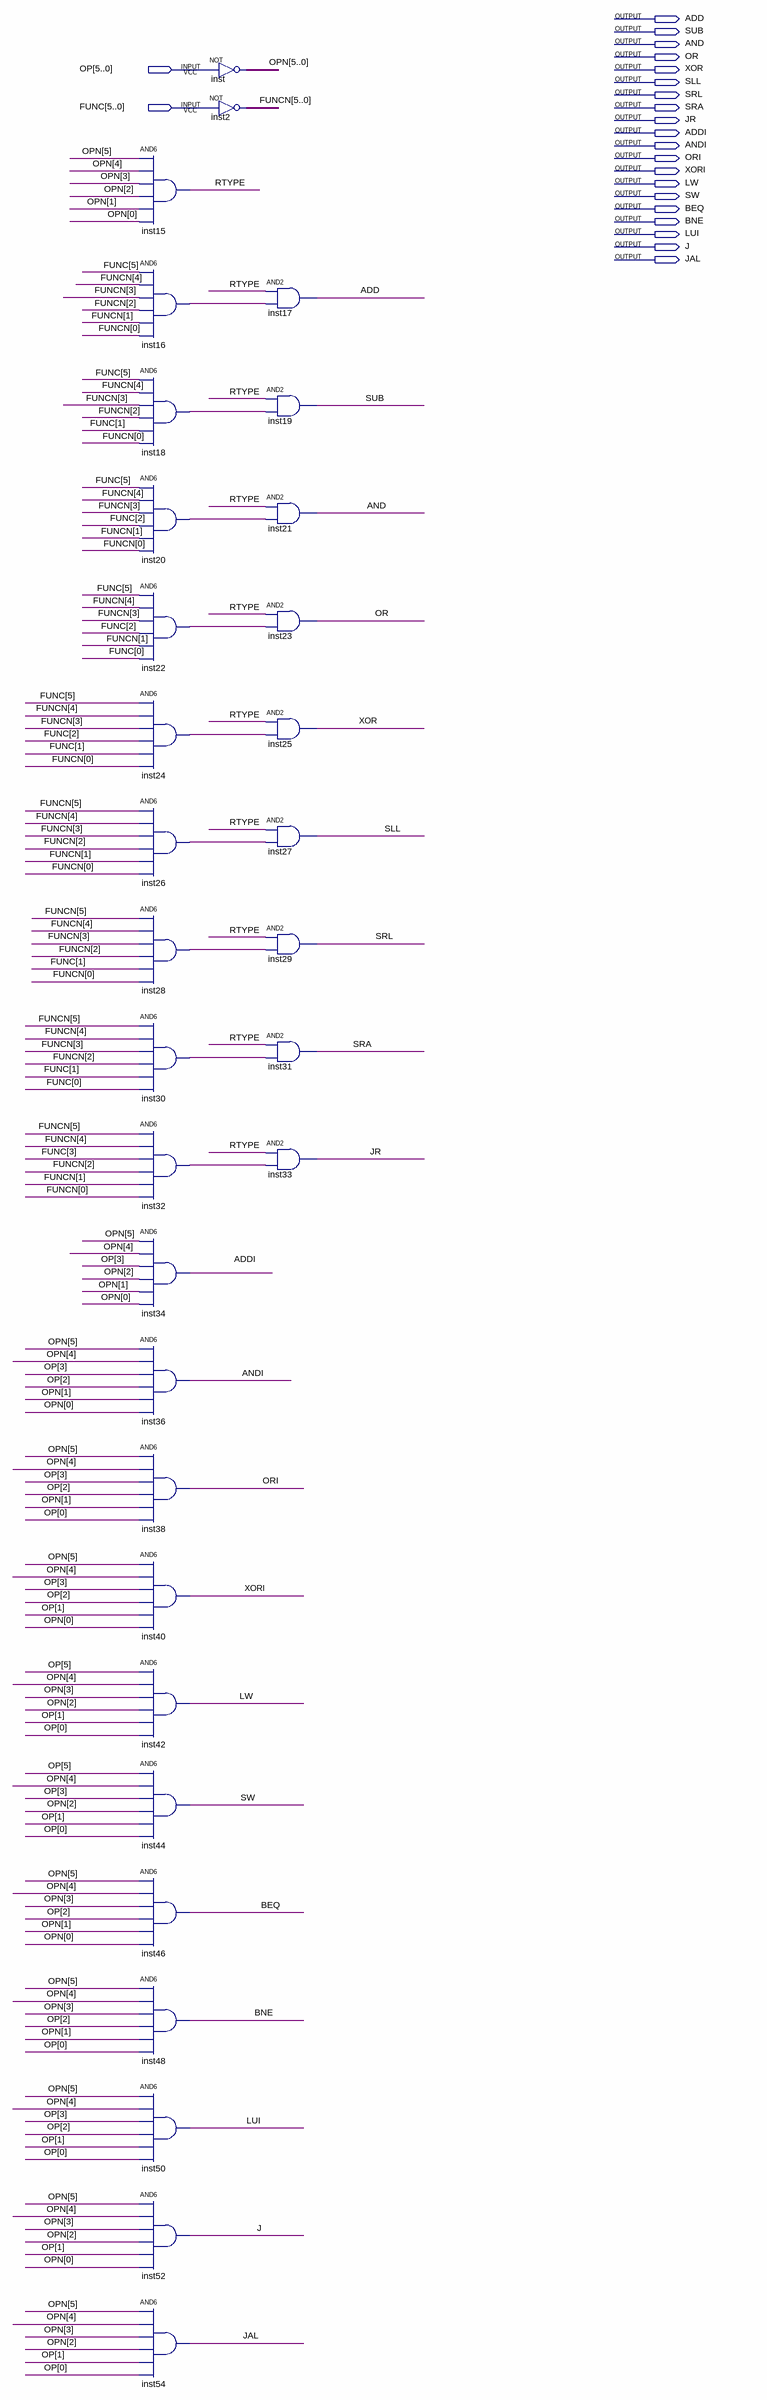
[diagram p0: schematic sheet]
// Quartus schematic instdex.bdf as structural Verilog: 32 symbols, 22 pins
module instdex (
  input  [5:0] OP,
  input  [5:0] FUNC,
  output ADD,
  output SUB,
  output AND,
  output OR,
  output XOR,
  output SLL,
  output SRL,
  output SRA,
  output JR,
  output ADDI,
  output ANDI,
  output ORI,
  output XORI,
  output LW,
  output SW,
  output BEQ,
  output BNE,
  output LUI,
  output J,
  output JAL
);

  wire inst16_out, inst18_out, inst20_out, inst22_out, inst24_out, inst26_out, inst28_out, inst30_out,
       inst32_out, RTYPE;
  wire [5:0] FUNCN, OPN;

  and inst15 (RTYPE, OPN[5], OPN[4], OPN[3], OPN[2], OPN[1], OPN[0]);
  and inst16 (inst16_out, FUNC[5], FUNCN[4], FUNCN[3], FUNCN[2], FUNCN[1], FUNCN[0]);
  and inst18 (inst18_out, FUNC[5], FUNCN[4], FUNCN[3], FUNCN[2], FUNC[1], FUNCN[0]);
  and inst20 (inst20_out, FUNC[5], FUNCN[4], FUNCN[3], FUNC[2], FUNCN[1], FUNCN[0]);
  and inst22 (inst22_out, FUNC[5], FUNCN[4], FUNCN[3], FUNC[2], FUNCN[1], FUNC[0]);
  and inst24 (inst24_out, FUNC[5], FUNCN[4], FUNCN[3], FUNC[2], FUNC[1], FUNCN[0]);
  and inst26 (inst26_out, FUNCN[5], FUNCN[4], FUNCN[3], FUNCN[2], FUNCN[1], FUNCN[0]);
  and inst28 (inst28_out, FUNCN[5], FUNCN[4], FUNCN[3], FUNCN[2], FUNC[1], FUNCN[0]);
  and inst30 (inst30_out, FUNCN[5], FUNCN[4], FUNCN[3], FUNCN[2], FUNC[1], FUNC[0]);
  and inst32 (inst32_out, FUNCN[5], FUNCN[4], FUNC[3], FUNCN[2], FUNCN[1], FUNCN[0]);
  and inst34 (ADDI, OPN[5], OPN[4], OP[3], OPN[2], OPN[1], OPN[0]);
  and inst36 (ANDI, OPN[5], OPN[4], OP[3], OP[2], OPN[1], OPN[0]);
  and inst38 (ORI, OPN[5], OPN[4], OP[3], OP[2], OPN[1], OP[0]);
  and inst40 (XORI, OPN[5], OPN[4], OP[3], OP[2], OP[1], OPN[0]);
  and inst42 (LW, OP[5], OPN[4], OPN[3], OPN[2], OP[1], OP[0]);
  and inst44 (SW, OP[5], OPN[4], OP[3], OPN[2], OP[1], OP[0]);
  and inst46 (BEQ, OPN[5], OPN[4], OPN[3], OP[2], OPN[1], OPN[0]);
  and inst48 (BNE, OPN[5], OPN[4], OPN[3], OP[2], OPN[1], OP[0]);
  and inst50 (LUI, OPN[5], OPN[4], OP[3], OP[2], OP[1], OP[0]);
  and inst52 (J, OPN[5], OPN[4], OPN[3], OPN[2], OP[1], OPN[0]);
  and inst54 (JAL, OPN[5], OPN[4], OPN[3], OPN[2], OP[1], OP[0]);
  assign OPN = ~OP;  // NOT inst, 6 bits wide
  assign FUNCN = ~FUNC;  // NOT inst2, 6 bits wide
  and inst17 (ADD, RTYPE, inst16_out);
  and inst19 (SUB, RTYPE, inst18_out);
  and inst21 (AND, RTYPE, inst20_out);
  and inst23 (OR, RTYPE, inst22_out);
  and inst25 (XOR, RTYPE, inst24_out);
  and inst27 (SLL, RTYPE, inst26_out);
  and inst29 (SRL, RTYPE, inst28_out);
  and inst31 (SRA, RTYPE, inst30_out);
  and inst33 (JR, RTYPE, inst32_out);
endmodule
